# Altium project 8x8_Crosspoint_Switch.PrjPcb (part 4 of 4)
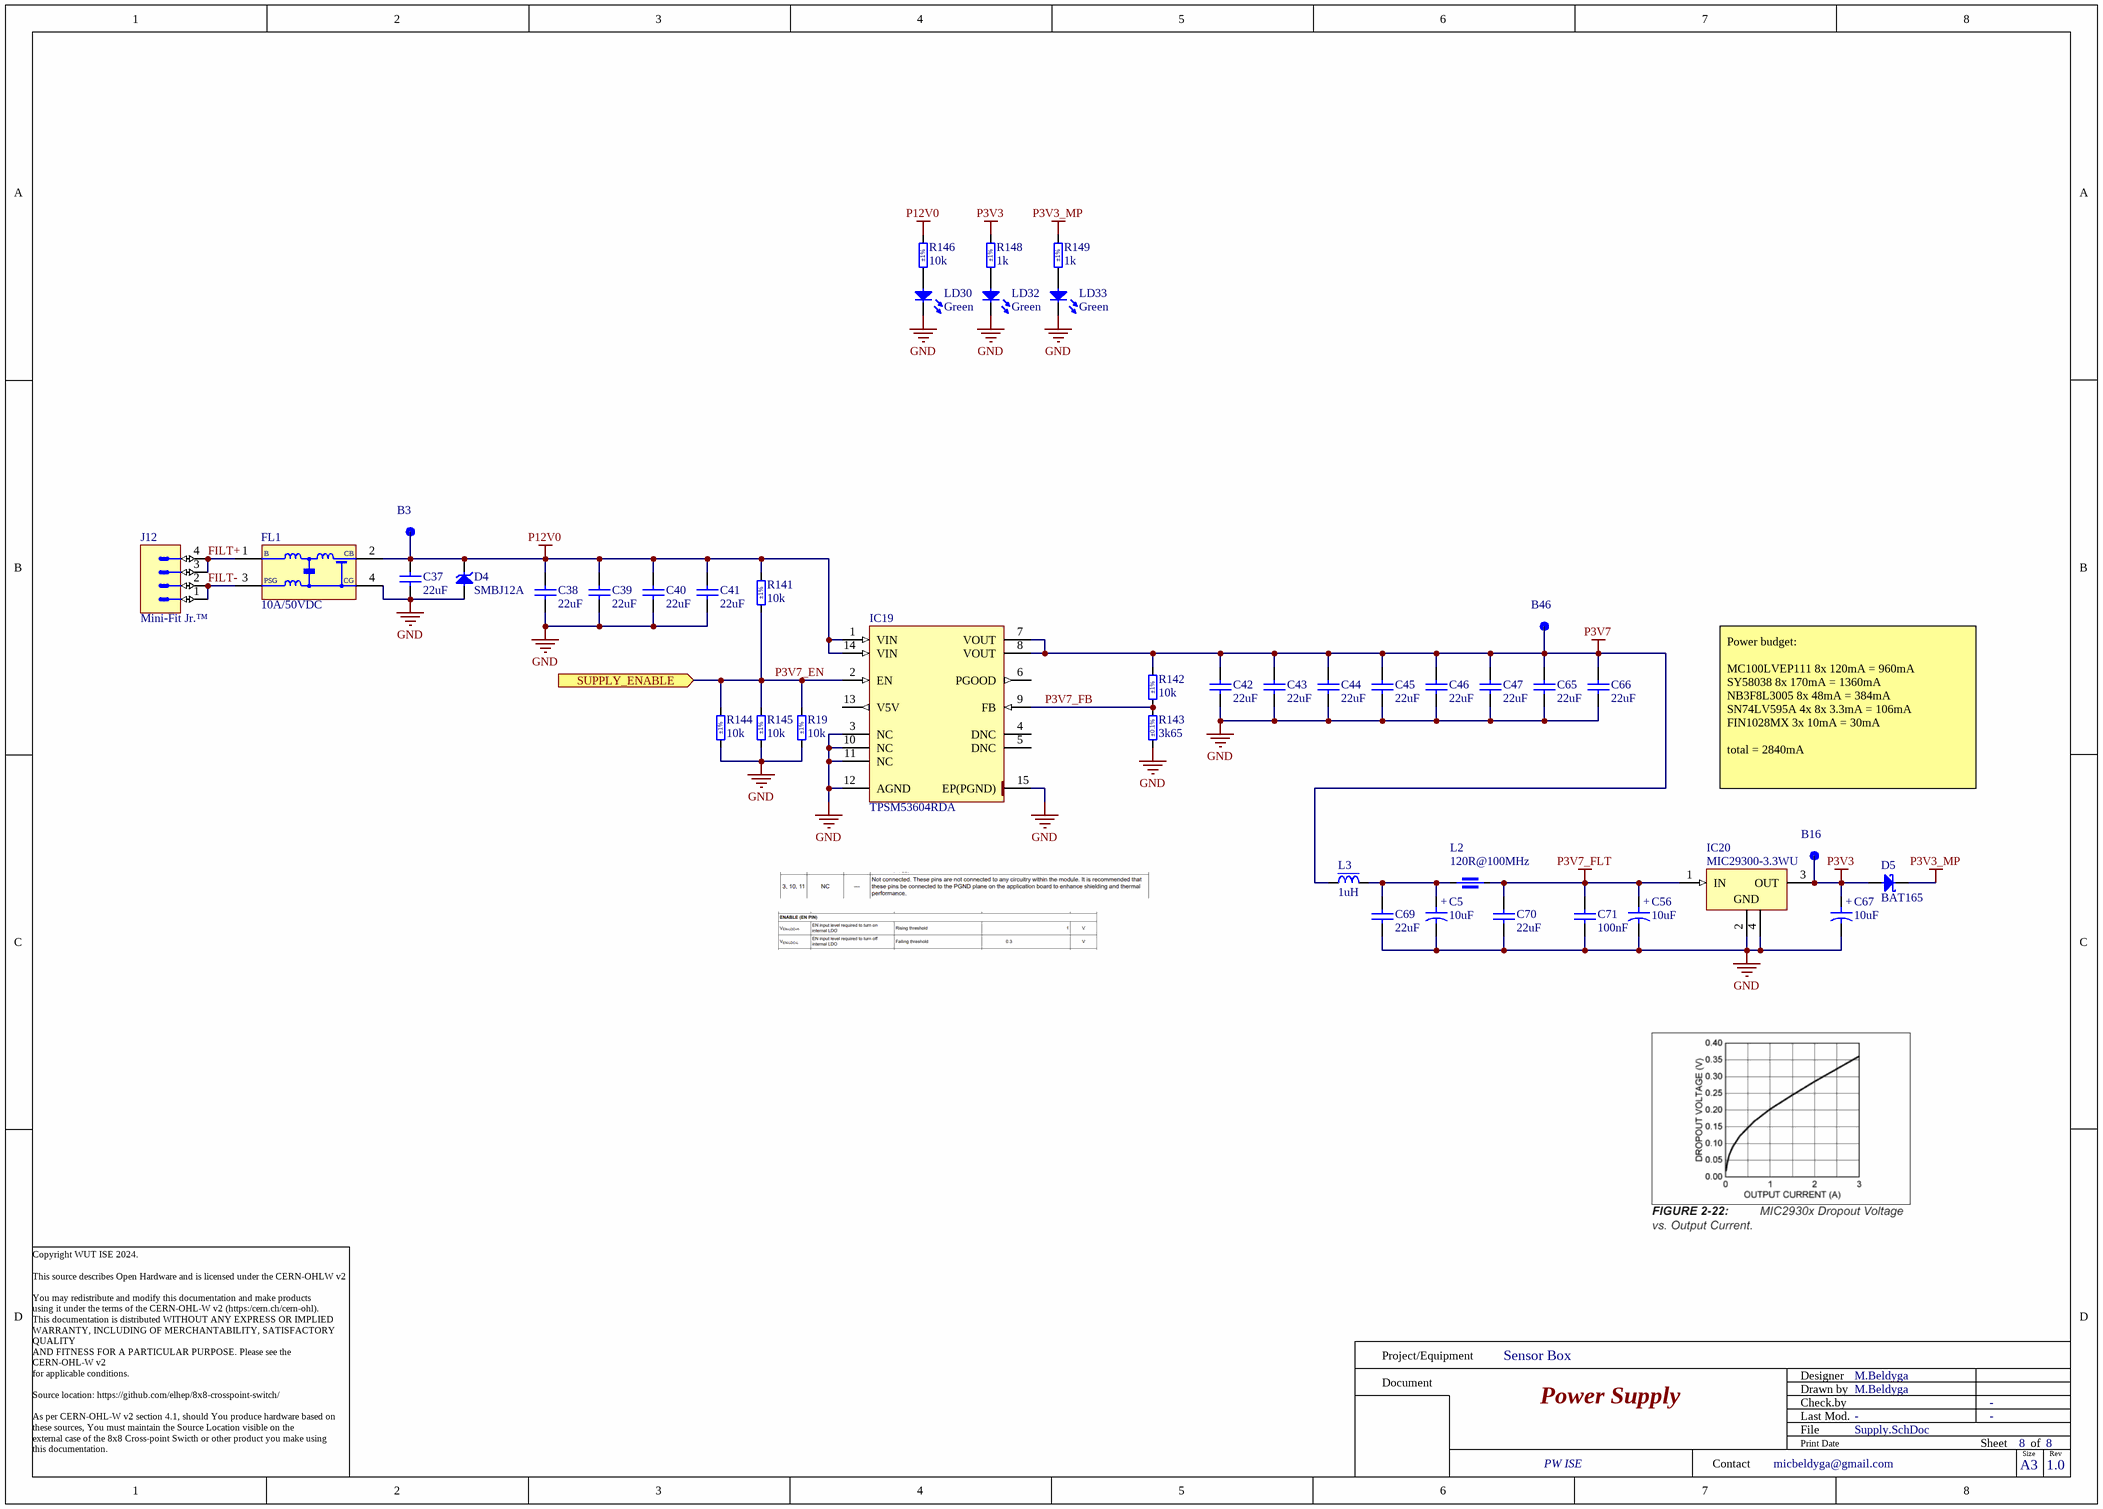
[diagram p8: Supply.SchDoc]

## Nets that join several sheets
GND: 8x8_Crosspoint (77 pins), U_Crosspoint/U_1-to-8_Fanout (12 pins), U_Crosspoint/U_1-to-8_Fanout (12 pins), U_Crosspoint/U_1-to-8_Fanout (12 pins), U_Crosspoint/U_1-to-8_Fanout (12 pins), U_Crosspoint/U_1-to-8_Fanout (12 pins), U_Crosspoint/U_1-to-8_Fanout (12 pins), U_Crosspoint/U_1-to-8_Fanout (12 pins), U_Crosspoint/U_1-to-8_Fanout (12 pins), U_Crosspoint/U_8-to-1_MUX (36 pins), U_Crosspoint/U_8-to-1_MUX (36 pins), U_Crosspoint/U_8-to-1_MUX (36 pins), U_Crosspoint/U_8-to-1_MUX (36 pins), U_Crosspoint/U_8-to-1_MUX (36 pins), U_Crosspoint/U_8-to-1_MUX (36 pins), U_Crosspoint/U_8-to-1_MUX (36 pins), U_Crosspoint/U_8-to-1_MUX (36 pins), Crosspoint_control (32 pins), DIOT_P1 (24 pins), EEM (38 pins), Supply (35 pins)
P3V3: 8x8_Crosspoint (B15.1 R18.2), U_Crosspoint/U_1-to-8_Fanout (C8A.2 C9A.2 D6A.1 L1A.1), U_Crosspoint/U_1-to-8_Fanout (C8B.2 C9B.2 D6B.1 L1B.1), U_Crosspoint/U_1-to-8_Fanout (C8C.2 C9C.2 D6C.1 L1C.1), U_Crosspoint/U_1-to-8_Fanout (C8D.2 C9D.2 D6D.1 L1D.1), U_Crosspoint/U_1-to-8_Fanout (C8E.2 C9E.2 D6E.1 L1E.1), U_Crosspoint/U_1-to-8_Fanout (C8F.2 C9F.2 D6F.1 L1F.1), U_Crosspoint/U_1-to-8_Fanout (C8G.2 C9G.2 D6G.1 L1G.1), U_Crosspoint/U_1-to-8_Fanout (C8H.2 C9H.2 D6H.1 L1H.1), U_Crosspoint/U_8-to-1_MUX (14 pins), U_Crosspoint/U_8-to-1_MUX (14 pins), U_Crosspoint/U_8-to-1_MUX (14 pins), U_Crosspoint/U_8-to-1_MUX (14 pins), U_Crosspoint/U_8-to-1_MUX (14 pins), U_Crosspoint/U_8-to-1_MUX (14 pins), U_Crosspoint/U_8-to-1_MUX (14 pins), U_Crosspoint/U_8-to-1_MUX (14 pins), Crosspoint_control (12 pins), DIOT_P1 (D2.4), EEM (12 pins), Supply (5 pins)
P3V3_MP: 8x8_Crosspoint (B14.1 D1.1 R17.2), DIOT_P1 (C27.2 IC8.14), EEM (19 pins), Supply (D5.1 R149.2)
P12V0: 8x8_Crosspoint (B17.1 R20.2), DIOT_P1 (7 pins), EEM (J11.28 J11.29), Supply (12 pins)
ARDU_CSn: 8x8_Crosspoint (R23.1), EEM (IC9.13)
ARDU_MISO: 8x8_Crosspoint (R28.1), EEM (IC12.3)
ARDU_MOSI: 8x8_Crosspoint (PCBM1.14), EEM (IC12.13)
ARDU_MUX: 8x8_Crosspoint (R21.1 R24.2), EEM (10 pins)
ARDU_OE: 8x8_Crosspoint (R22.1 R25.2), EEM (IC9.3)
ARDU_SCK: 8x8_Crosspoint (R33.2), EEM (IC12.1)
ARDU_SCL: 8x8_Crosspoint (B18.1 PCBM1.24), EEM (IC17.8 IC17.11 R137.1)
ARDU_SDA: 8x8_Crosspoint (B19.1 PCBM1.23), EEM (IC17.1 IC17.4 R128.1)
CLK_0_OUT_0.CLK_N: U_Crosspoint/U_1-to-8_Fanout (IC1A.30), U_Crosspoint/U_8-to-1_MUX (IC3A.36)
CLK_0_OUT_0.CLK_P: U_Crosspoint/U_1-to-8_Fanout (IC1A.31), U_Crosspoint/U_8-to-1_MUX (IC3A.38)
CLK_0_OUT_1.CLK_N: U_Crosspoint/U_1-to-8_Fanout (IC1A.28), U_Crosspoint/U_8-to-1_MUX (IC3B.36)
CLK_0_OUT_1.CLK_P: U_Crosspoint/U_1-to-8_Fanout (IC1A.29), U_Crosspoint/U_8-to-1_MUX (IC3B.38)
CLK_0_OUT_2.CLK_N: U_Crosspoint/U_1-to-8_Fanout (IC1A.26), U_Crosspoint/U_8-to-1_MUX (IC3C.36)
CLK_0_OUT_2.CLK_P: U_Crosspoint/U_1-to-8_Fanout (IC1A.27), U_Crosspoint/U_8-to-1_MUX (IC3C.38)
CLK_0_OUT_3.CLK_N: U_Crosspoint/U_1-to-8_Fanout (IC1A.23), U_Crosspoint/U_8-to-1_MUX (IC3D.36)
CLK_0_OUT_3.CLK_P: U_Crosspoint/U_1-to-8_Fanout (IC1A.24), U_Crosspoint/U_8-to-1_MUX (IC3D.38)
CLK_0_OUT_4.CLK_N: U_Crosspoint/U_1-to-8_Fanout (IC1A.21), U_Crosspoint/U_8-to-1_MUX (IC3E.36)
CLK_0_OUT_4.CLK_P: U_Crosspoint/U_1-to-8_Fanout (IC1A.22), U_Crosspoint/U_8-to-1_MUX (IC3E.38)
CLK_0_OUT_5.CLK_N: U_Crosspoint/U_1-to-8_Fanout (IC1A.19), U_Crosspoint/U_8-to-1_MUX (IC3F.36)
CLK_0_OUT_5.CLK_P: U_Crosspoint/U_1-to-8_Fanout (IC1A.20), U_Crosspoint/U_8-to-1_MUX (IC3F.38)
CLK_0_OUT_6.CLK_N: U_Crosspoint/U_1-to-8_Fanout (IC1A.17), U_Crosspoint/U_8-to-1_MUX (IC3G.36)
CLK_0_OUT_6.CLK_P: U_Crosspoint/U_1-to-8_Fanout (IC1A.18), U_Crosspoint/U_8-to-1_MUX (IC3G.38)
CLK_0_OUT_7.CLK_N: U_Crosspoint/U_1-to-8_Fanout (IC1A.14), U_Crosspoint/U_8-to-1_MUX (IC3H.36)
CLK_0_OUT_7.CLK_P: U_Crosspoint/U_1-to-8_Fanout (IC1A.15), U_Crosspoint/U_8-to-1_MUX (IC3H.38)
CLK_1_OUT_0.CLK_N: U_Crosspoint/U_1-to-8_Fanout (IC1B.30), U_Crosspoint/U_8-to-1_MUX (IC3A.40)
CLK_1_OUT_0.CLK_P: U_Crosspoint/U_1-to-8_Fanout (IC1B.31), U_Crosspoint/U_8-to-1_MUX (IC3A.42)
CLK_1_OUT_1.CLK_N: U_Crosspoint/U_1-to-8_Fanout (IC1B.28), U_Crosspoint/U_8-to-1_MUX (IC3B.40)
CLK_1_OUT_1.CLK_P: U_Crosspoint/U_1-to-8_Fanout (IC1B.29), U_Crosspoint/U_8-to-1_MUX (IC3B.42)
CLK_1_OUT_2.CLK_N: U_Crosspoint/U_1-to-8_Fanout (IC1B.26), U_Crosspoint/U_8-to-1_MUX (IC3C.40)
CLK_1_OUT_2.CLK_P: U_Crosspoint/U_1-to-8_Fanout (IC1B.27), U_Crosspoint/U_8-to-1_MUX (IC3C.42)
CLK_1_OUT_3.CLK_N: U_Crosspoint/U_1-to-8_Fanout (IC1B.23), U_Crosspoint/U_8-to-1_MUX (IC3D.40)
CLK_1_OUT_3.CLK_P: U_Crosspoint/U_1-to-8_Fanout (IC1B.24), U_Crosspoint/U_8-to-1_MUX (IC3D.42)
CLK_1_OUT_4.CLK_N: U_Crosspoint/U_1-to-8_Fanout (IC1B.21), U_Crosspoint/U_8-to-1_MUX (IC3E.40)
CLK_1_OUT_4.CLK_P: U_Crosspoint/U_1-to-8_Fanout (IC1B.22), U_Crosspoint/U_8-to-1_MUX (IC3E.42)
CLK_1_OUT_5.CLK_N: U_Crosspoint/U_1-to-8_Fanout (IC1B.19), U_Crosspoint/U_8-to-1_MUX (IC3F.40)
CLK_1_OUT_5.CLK_P: U_Crosspoint/U_1-to-8_Fanout (IC1B.20), U_Crosspoint/U_8-to-1_MUX (IC3F.42)
CLK_1_OUT_6.CLK_N: U_Crosspoint/U_1-to-8_Fanout (IC1B.17), U_Crosspoint/U_8-to-1_MUX (IC3G.40)
CLK_1_OUT_6.CLK_P: U_Crosspoint/U_1-to-8_Fanout (IC1B.18), U_Crosspoint/U_8-to-1_MUX (IC3G.42)
CLK_1_OUT_7.CLK_N: U_Crosspoint/U_1-to-8_Fanout (IC1B.14), U_Crosspoint/U_8-to-1_MUX (IC3H.40)
CLK_1_OUT_7.CLK_P: U_Crosspoint/U_1-to-8_Fanout (IC1B.15), U_Crosspoint/U_8-to-1_MUX (IC3H.42)
CLK_2_OUT_0.CLK_N: U_Crosspoint/U_1-to-8_Fanout (IC1C.30), U_Crosspoint/U_8-to-1_MUX (IC3A.43)
CLK_2_OUT_0.CLK_P: U_Crosspoint/U_1-to-8_Fanout (IC1C.31), U_Crosspoint/U_8-to-1_MUX (IC3A.1)
CLK_2_OUT_1.CLK_N: U_Crosspoint/U_1-to-8_Fanout (IC1C.28), U_Crosspoint/U_8-to-1_MUX (IC3B.43)
CLK_2_OUT_1.CLK_P: U_Crosspoint/U_1-to-8_Fanout (IC1C.29), U_Crosspoint/U_8-to-1_MUX (IC3B.1)
CLK_2_OUT_2.CLK_N: U_Crosspoint/U_1-to-8_Fanout (IC1C.26), U_Crosspoint/U_8-to-1_MUX (IC3C.43)
CLK_2_OUT_2.CLK_P: U_Crosspoint/U_1-to-8_Fanout (IC1C.27), U_Crosspoint/U_8-to-1_MUX (IC3C.1)
CLK_2_OUT_3.CLK_N: U_Crosspoint/U_1-to-8_Fanout (IC1C.23), U_Crosspoint/U_8-to-1_MUX (IC3D.43)
CLK_2_OUT_3.CLK_P: U_Crosspoint/U_1-to-8_Fanout (IC1C.24), U_Crosspoint/U_8-to-1_MUX (IC3D.1)
CLK_2_OUT_4.CLK_N: U_Crosspoint/U_1-to-8_Fanout (IC1C.21), U_Crosspoint/U_8-to-1_MUX (IC3E.43)
CLK_2_OUT_4.CLK_P: U_Crosspoint/U_1-to-8_Fanout (IC1C.22), U_Crosspoint/U_8-to-1_MUX (IC3E.1)
CLK_2_OUT_5.CLK_N: U_Crosspoint/U_1-to-8_Fanout (IC1C.19), U_Crosspoint/U_8-to-1_MUX (IC3F.43)
CLK_2_OUT_5.CLK_P: U_Crosspoint/U_1-to-8_Fanout (IC1C.20), U_Crosspoint/U_8-to-1_MUX (IC3F.1)
CLK_2_OUT_6.CLK_N: U_Crosspoint/U_1-to-8_Fanout (IC1C.17), U_Crosspoint/U_8-to-1_MUX (IC3G.43)
CLK_2_OUT_6.CLK_P: U_Crosspoint/U_1-to-8_Fanout (IC1C.18), U_Crosspoint/U_8-to-1_MUX (IC3G.1)
CLK_2_OUT_7.CLK_N: U_Crosspoint/U_1-to-8_Fanout (IC1C.14), U_Crosspoint/U_8-to-1_MUX (IC3H.43)
CLK_2_OUT_7.CLK_P: U_Crosspoint/U_1-to-8_Fanout (IC1C.15), U_Crosspoint/U_8-to-1_MUX (IC3H.1)
CLK_3_OUT_0.CLK_N: U_Crosspoint/U_1-to-8_Fanout (IC1D.30), U_Crosspoint/U_8-to-1_MUX (IC3A.3)
CLK_3_OUT_0.CLK_P: U_Crosspoint/U_1-to-8_Fanout (IC1D.31), U_Crosspoint/U_8-to-1_MUX (IC3A.5)
CLK_3_OUT_1.CLK_N: U_Crosspoint/U_1-to-8_Fanout (IC1D.28), U_Crosspoint/U_8-to-1_MUX (IC3B.3)
CLK_3_OUT_1.CLK_P: U_Crosspoint/U_1-to-8_Fanout (IC1D.29), U_Crosspoint/U_8-to-1_MUX (IC3B.5)
CLK_3_OUT_2.CLK_N: U_Crosspoint/U_1-to-8_Fanout (IC1D.26), U_Crosspoint/U_8-to-1_MUX (IC3C.3)
CLK_3_OUT_2.CLK_P: U_Crosspoint/U_1-to-8_Fanout (IC1D.27), U_Crosspoint/U_8-to-1_MUX (IC3C.5)
CLK_3_OUT_3.CLK_N: U_Crosspoint/U_1-to-8_Fanout (IC1D.23), U_Crosspoint/U_8-to-1_MUX (IC3D.3)
CLK_3_OUT_3.CLK_P: U_Crosspoint/U_1-to-8_Fanout (IC1D.24), U_Crosspoint/U_8-to-1_MUX (IC3D.5)
CLK_3_OUT_4.CLK_N: U_Crosspoint/U_1-to-8_Fanout (IC1D.21), U_Crosspoint/U_8-to-1_MUX (IC3E.3)
CLK_3_OUT_4.CLK_P: U_Crosspoint/U_1-to-8_Fanout (IC1D.22), U_Crosspoint/U_8-to-1_MUX (IC3E.5)
CLK_3_OUT_5.CLK_N: U_Crosspoint/U_1-to-8_Fanout (IC1D.19), U_Crosspoint/U_8-to-1_MUX (IC3F.3)
CLK_3_OUT_5.CLK_P: U_Crosspoint/U_1-to-8_Fanout (IC1D.20), U_Crosspoint/U_8-to-1_MUX (IC3F.5)
CLK_3_OUT_6.CLK_N: U_Crosspoint/U_1-to-8_Fanout (IC1D.17), U_Crosspoint/U_8-to-1_MUX (IC3G.3)
CLK_3_OUT_6.CLK_P: U_Crosspoint/U_1-to-8_Fanout (IC1D.18), U_Crosspoint/U_8-to-1_MUX (IC3G.5)
CLK_3_OUT_7.CLK_N: U_Crosspoint/U_1-to-8_Fanout (IC1D.14), U_Crosspoint/U_8-to-1_MUX (IC3H.3)
CLK_3_OUT_7.CLK_P: U_Crosspoint/U_1-to-8_Fanout (IC1D.15), U_Crosspoint/U_8-to-1_MUX (IC3H.5)
CLK_4_OUT_0.CLK_N: U_Crosspoint/U_1-to-8_Fanout (IC1E.30), U_Crosspoint/U_8-to-1_MUX (IC3A.7)
CLK_4_OUT_0.CLK_P: U_Crosspoint/U_1-to-8_Fanout (IC1E.31), U_Crosspoint/U_8-to-1_MUX (IC3A.9)
CLK_4_OUT_1.CLK_N: U_Crosspoint/U_1-to-8_Fanout (IC1E.28), U_Crosspoint/U_8-to-1_MUX (IC3B.7)
CLK_4_OUT_1.CLK_P: U_Crosspoint/U_1-to-8_Fanout (IC1E.29), U_Crosspoint/U_8-to-1_MUX (IC3B.9)
CLK_4_OUT_2.CLK_N: U_Crosspoint/U_1-to-8_Fanout (IC1E.26), U_Crosspoint/U_8-to-1_MUX (IC3C.7)
CLK_4_OUT_2.CLK_P: U_Crosspoint/U_1-to-8_Fanout (IC1E.27), U_Crosspoint/U_8-to-1_MUX (IC3C.9)
CLK_4_OUT_3.CLK_N: U_Crosspoint/U_1-to-8_Fanout (IC1E.23), U_Crosspoint/U_8-to-1_MUX (IC3D.7)
CLK_4_OUT_3.CLK_P: U_Crosspoint/U_1-to-8_Fanout (IC1E.24), U_Crosspoint/U_8-to-1_MUX (IC3D.9)
CLK_4_OUT_4.CLK_N: U_Crosspoint/U_1-to-8_Fanout (IC1E.21), U_Crosspoint/U_8-to-1_MUX (IC3E.7)
CLK_4_OUT_4.CLK_P: U_Crosspoint/U_1-to-8_Fanout (IC1E.22), U_Crosspoint/U_8-to-1_MUX (IC3E.9)
CLK_4_OUT_5.CLK_N: U_Crosspoint/U_1-to-8_Fanout (IC1E.19), U_Crosspoint/U_8-to-1_MUX (IC3F.7)
CLK_4_OUT_5.CLK_P: U_Crosspoint/U_1-to-8_Fanout (IC1E.20), U_Crosspoint/U_8-to-1_MUX (IC3F.9)
CLK_4_OUT_6.CLK_N: U_Crosspoint/U_1-to-8_Fanout (IC1E.17), U_Crosspoint/U_8-to-1_MUX (IC3G.7)
CLK_4_OUT_6.CLK_P: U_Crosspoint/U_1-to-8_Fanout (IC1E.18), U_Crosspoint/U_8-to-1_MUX (IC3G.9)
CLK_4_OUT_7.CLK_N: U_Crosspoint/U_1-to-8_Fanout (IC1E.14), U_Crosspoint/U_8-to-1_MUX (IC3H.7)
CLK_4_OUT_7.CLK_P: U_Crosspoint/U_1-to-8_Fanout (IC1E.15), U_Crosspoint/U_8-to-1_MUX (IC3H.9)
CLK_5_OUT_0.CLK_N: U_Crosspoint/U_1-to-8_Fanout (IC1F.30), U_Crosspoint/U_8-to-1_MUX (IC3A.11)
CLK_5_OUT_0.CLK_P: U_Crosspoint/U_1-to-8_Fanout (IC1F.31), U_Crosspoint/U_8-to-1_MUX (IC3A.13)
CLK_5_OUT_1.CLK_N: U_Crosspoint/U_1-to-8_Fanout (IC1F.28), U_Crosspoint/U_8-to-1_MUX (IC3B.11)
CLK_5_OUT_1.CLK_P: U_Crosspoint/U_1-to-8_Fanout (IC1F.29), U_Crosspoint/U_8-to-1_MUX (IC3B.13)
CLK_5_OUT_2.CLK_N: U_Crosspoint/U_1-to-8_Fanout (IC1F.26), U_Crosspoint/U_8-to-1_MUX (IC3C.11)
CLK_5_OUT_2.CLK_P: U_Crosspoint/U_1-to-8_Fanout (IC1F.27), U_Crosspoint/U_8-to-1_MUX (IC3C.13)
CLK_5_OUT_3.CLK_N: U_Crosspoint/U_1-to-8_Fanout (IC1F.23), U_Crosspoint/U_8-to-1_MUX (IC3D.11)
CLK_5_OUT_3.CLK_P: U_Crosspoint/U_1-to-8_Fanout (IC1F.24), U_Crosspoint/U_8-to-1_MUX (IC3D.13)
CLK_5_OUT_4.CLK_N: U_Crosspoint/U_1-to-8_Fanout (IC1F.21), U_Crosspoint/U_8-to-1_MUX (IC3E.11)
CLK_5_OUT_4.CLK_P: U_Crosspoint/U_1-to-8_Fanout (IC1F.22), U_Crosspoint/U_8-to-1_MUX (IC3E.13)
CLK_5_OUT_5.CLK_N: U_Crosspoint/U_1-to-8_Fanout (IC1F.19), U_Crosspoint/U_8-to-1_MUX (IC3F.11)
CLK_5_OUT_5.CLK_P: U_Crosspoint/U_1-to-8_Fanout (IC1F.20), U_Crosspoint/U_8-to-1_MUX (IC3F.13)
CLK_5_OUT_6.CLK_N: U_Crosspoint/U_1-to-8_Fanout (IC1F.17), U_Crosspoint/U_8-to-1_MUX (IC3G.11)
CLK_5_OUT_6.CLK_P: U_Crosspoint/U_1-to-8_Fanout (IC1F.18), U_Crosspoint/U_8-to-1_MUX (IC3G.13)
CLK_5_OUT_7.CLK_N: U_Crosspoint/U_1-to-8_Fanout (IC1F.14), U_Crosspoint/U_8-to-1_MUX (IC3H.11)
CLK_5_OUT_7.CLK_P: U_Crosspoint/U_1-to-8_Fanout (IC1F.15), U_Crosspoint/U_8-to-1_MUX (IC3H.13)
CLK_6_OUT_0.CLK_N: U_Crosspoint/U_1-to-8_Fanout (IC1G.30), U_Crosspoint/U_8-to-1_MUX (IC3A.14)
CLK_6_OUT_0.CLK_P: U_Crosspoint/U_1-to-8_Fanout (IC1G.31), U_Crosspoint/U_8-to-1_MUX (IC3A.16)
CLK_6_OUT_1.CLK_N: U_Crosspoint/U_1-to-8_Fanout (IC1G.28), U_Crosspoint/U_8-to-1_MUX (IC3B.14)
CLK_6_OUT_1.CLK_P: U_Crosspoint/U_1-to-8_Fanout (IC1G.29), U_Crosspoint/U_8-to-1_MUX (IC3B.16)
CLK_6_OUT_2.CLK_N: U_Crosspoint/U_1-to-8_Fanout (IC1G.26), U_Crosspoint/U_8-to-1_MUX (IC3C.14)
CLK_6_OUT_2.CLK_P: U_Crosspoint/U_1-to-8_Fanout (IC1G.27), U_Crosspoint/U_8-to-1_MUX (IC3C.16)
CLK_6_OUT_3.CLK_N: U_Crosspoint/U_1-to-8_Fanout (IC1G.23), U_Crosspoint/U_8-to-1_MUX (IC3D.14)
CLK_6_OUT_3.CLK_P: U_Crosspoint/U_1-to-8_Fanout (IC1G.24), U_Crosspoint/U_8-to-1_MUX (IC3D.16)
CLK_6_OUT_4.CLK_N: U_Crosspoint/U_1-to-8_Fanout (IC1G.21), U_Crosspoint/U_8-to-1_MUX (IC3E.14)
CLK_6_OUT_4.CLK_P: U_Crosspoint/U_1-to-8_Fanout (IC1G.22), U_Crosspoint/U_8-to-1_MUX (IC3E.16)
CLK_6_OUT_5.CLK_N: U_Crosspoint/U_1-to-8_Fanout (IC1G.19), U_Crosspoint/U_8-to-1_MUX (IC3F.14)
CLK_6_OUT_5.CLK_P: U_Crosspoint/U_1-to-8_Fanout (IC1G.20), U_Crosspoint/U_8-to-1_MUX (IC3F.16)
CLK_6_OUT_6.CLK_N: U_Crosspoint/U_1-to-8_Fanout (IC1G.17), U_Crosspoint/U_8-to-1_MUX (IC3G.14)
CLK_6_OUT_6.CLK_P: U_Crosspoint/U_1-to-8_Fanout (IC1G.18), U_Crosspoint/U_8-to-1_MUX (IC3G.16)
CLK_6_OUT_7.CLK_N: U_Crosspoint/U_1-to-8_Fanout (IC1G.14), U_Crosspoint/U_8-to-1_MUX (IC3H.14)
CLK_6_OUT_7.CLK_P: U_Crosspoint/U_1-to-8_Fanout (IC1G.15), U_Crosspoint/U_8-to-1_MUX (IC3H.16)
CLK_7_OUT_0.CLK_N: U_Crosspoint/U_1-to-8_Fanout (IC1H.30), U_Crosspoint/U_8-to-1_MUX (IC3A.18)
CLK_7_OUT_0.CLK_P: U_Crosspoint/U_1-to-8_Fanout (IC1H.31), U_Crosspoint/U_8-to-1_MUX (IC3A.20)
CLK_7_OUT_1.CLK_N: U_Crosspoint/U_1-to-8_Fanout (IC1H.28), U_Crosspoint/U_8-to-1_MUX (IC3B.18)
CLK_7_OUT_1.CLK_P: U_Crosspoint/U_1-to-8_Fanout (IC1H.29), U_Crosspoint/U_8-to-1_MUX (IC3B.20)
CLK_7_OUT_2.CLK_N: U_Crosspoint/U_1-to-8_Fanout (IC1H.26), U_Crosspoint/U_8-to-1_MUX (IC3C.18)
CLK_7_OUT_2.CLK_P: U_Crosspoint/U_1-to-8_Fanout (IC1H.27), U_Crosspoint/U_8-to-1_MUX (IC3C.20)
CLK_7_OUT_3.CLK_N: U_Crosspoint/U_1-to-8_Fanout (IC1H.23), U_Crosspoint/U_8-to-1_MUX (IC3D.18)
CLK_7_OUT_3.CLK_P: U_Crosspoint/U_1-to-8_Fanout (IC1H.24), U_Crosspoint/U_8-to-1_MUX (IC3D.20)
CLK_7_OUT_4.CLK_N: U_Crosspoint/U_1-to-8_Fanout (IC1H.21), U_Crosspoint/U_8-to-1_MUX (IC3E.18)
CLK_7_OUT_4.CLK_P: U_Crosspoint/U_1-to-8_Fanout (IC1H.22), U_Crosspoint/U_8-to-1_MUX (IC3E.20)
CLK_7_OUT_5.CLK_N: U_Crosspoint/U_1-to-8_Fanout (IC1H.19), U_Crosspoint/U_8-to-1_MUX (IC3F.18)
CLK_7_OUT_5.CLK_P: U_Crosspoint/U_1-to-8_Fanout (IC1H.20), U_Crosspoint/U_8-to-1_MUX (IC3F.20)
CLK_7_OUT_6.CLK_N: U_Crosspoint/U_1-to-8_Fanout (IC1H.17), U_Crosspoint/U_8-to-1_MUX (IC3G.18)
CLK_7_OUT_6.CLK_P: U_Crosspoint/U_1-to-8_Fanout (IC1H.18), U_Crosspoint/U_8-to-1_MUX (IC3G.20)
CLK_7_OUT_7.CLK_N: U_Crosspoint/U_1-to-8_Fanout (IC1H.14), U_Crosspoint/U_8-to-1_MUX (IC3H.18)
CLK_7_OUT_7.CLK_P: U_Crosspoint/U_1-to-8_Fanout (IC1H.15), U_Crosspoint/U_8-to-1_MUX (IC3H.20)
CLK_IN_0: 8x8_Crosspoint (J1.1 R1.2), U_Crosspoint/U_1-to-8_Fanout (R153A.1)
CLK_IN_1: 8x8_Crosspoint (J2.1 R2.2), U_Crosspoint/U_1-to-8_Fanout (R153B.1)
CLK_IN_2: 8x8_Crosspoint (J4.1 R3.2), U_Crosspoint/U_1-to-8_Fanout (R153C.1)
CLK_IN_3: 8x8_Crosspoint (J5.1 R4.2), U_Crosspoint/U_1-to-8_Fanout (R153D.1)
CLK_IN_4: 8x8_Crosspoint (J6.1 R5.2), U_Crosspoint/U_1-to-8_Fanout (R153E.1)
CLK_IN_5: 8x8_Crosspoint (J7.1 R6.2), U_Crosspoint/U_1-to-8_Fanout (R153F.1)
CLK_IN_6: 8x8_Crosspoint (J8.1 R7.2), U_Crosspoint/U_1-to-8_Fanout (R153G.1)
CLK_IN_7: 8x8_Crosspoint (J9.1 R8.2), U_Crosspoint/U_1-to-8_Fanout (R153H.1)
CLK_OUT_0: 8x8_Crosspoint (J3.23), U_Crosspoint/U_8-to-1_MUX (F1A.2)
CLK_OUT_1: 8x8_Crosspoint (J3.20), U_Crosspoint/U_8-to-1_MUX (F1B.2)
CLK_OUT_2: 8x8_Crosspoint (J3.17), U_Crosspoint/U_8-to-1_MUX (F1C.2)
CLK_OUT_3: 8x8_Crosspoint (J3.14), U_Crosspoint/U_8-to-1_MUX (F1D.2)
CLK_OUT_4: 8x8_Crosspoint (J3.11), U_Crosspoint/U_8-to-1_MUX (F1E.2)
CLK_OUT_5: 8x8_Crosspoint (J3.8), U_Crosspoint/U_8-to-1_MUX (F1F.2)
CLK_OUT_6: 8x8_Crosspoint (J3.5), U_Crosspoint/U_8-to-1_MUX (F1G.2)
CLK_OUT_7: 8x8_Crosspoint (J3.2), U_Crosspoint/U_8-to-1_MUX (F1H.2)
DESER_CSn: Crosspoint_control (IC4.12 IC5.12 IC6.12 IC7.12), EEM (IC9.14 IC16.1)
DESER_MISO: Crosspoint_control (IC7.9), EEM (IC16.2)
DESER_MOSI: Crosspoint_control (IC4.14), EEM (IC12.14)
DESER_~{OE}: Crosspoint_control (IC4.13 IC5.13 IC6.13 IC7.13), EEM (IC9.4)
DESER_SCK: Crosspoint_control (IC4.11 IC5.11 IC6.11 IC7.11), EEM (IC12.15)
EEM0_0_N: DIOT_P1 (R104.2), EEM (IC11.4 J11.3 R126.2)
EEM0_0_P: DIOT_P1 (R103.2), EEM (IC11.3 J11.2 R126.1)
EEM0_1_N: DIOT_P1 (R106.2), EEM (IC11.1 J11.6 R124.1)
EEM0_1_P: DIOT_P1 (R105.2), EEM (IC11.2 J11.5 R124.2)
EEM0_2_N: DIOT_P1 (R108.2), EEM (IC14.7 J11.9)
EEM0_2_P: DIOT_P1 (R107.2), EEM (IC14.8 J11.8)
EEM0_3_N: DIOT_P1 (R110.2), EEM (IC10.3 J11.12 R122.1)
EEM0_3_P: DIOT_P1 (R109.2), EEM (IC10.4 J11.11 R122.2)
EEM0_4_N: DIOT_P1 (R112.2), EEM (J11.15)
EEM0_4_P: DIOT_P1 (R111.2), EEM (J11.14)
EEM0_5_N: DIOT_P1 (R114.2), EEM (IC10.2 J11.18 R120.2)
EEM0_5_P: DIOT_P1 (R113.2), EEM (IC10.1 J11.17 R120.1)
EEM0_6_N: DIOT_P1 (R116.2), EEM (J11.21)
EEM0_6_P: DIOT_P1 (R115.2), EEM (J11.20)
EEM0_7_N: DIOT_P1 (R118.2), EEM (J11.24)
EEM0_7_P: DIOT_P1 (R117.2), EEM (J11.23)
I2C0_SCL: DIOT_P1 (B27.1 IC8.9 IC8.10), EEM (8 pins)
I2C0_SDA: DIOT_P1 (B26.1 IC8.2 IC8.3), EEM (8 pins)
OUT_0_SEL_0: U_Crosspoint/U_8-to-1_MUX (IC3A.21), Crosspoint_control (R53.2)
OUT_0_SEL_1: U_Crosspoint/U_8-to-1_MUX (IC3A.22), Crosspoint_control (R55.2)
OUT_0_SEL_2: U_Crosspoint/U_8-to-1_MUX (IC3A.35), Crosspoint_control (R46.2)
OUT_1_SEL_0: U_Crosspoint/U_8-to-1_MUX (IC3B.21), Crosspoint_control (R49.2)
OUT_1_SEL_1: U_Crosspoint/U_8-to-1_MUX (IC3B.22), Crosspoint_control (R50.2)
OUT_1_SEL_2: U_Crosspoint/U_8-to-1_MUX (IC3B.35), Crosspoint_control (R52.2)
OUT_2_SEL_0: U_Crosspoint/U_8-to-1_MUX (IC3C.21), Crosspoint_control (R64.2)
OUT_2_SEL_1: U_Crosspoint/U_8-to-1_MUX (IC3C.22), Crosspoint_control (R47.2)
OUT_2_SEL_2: U_Crosspoint/U_8-to-1_MUX (IC3C.35), Crosspoint_control (R48.2)
OUT_3_SEL_0: U_Crosspoint/U_8-to-1_MUX (IC3D.21), Crosspoint_control (R72.2)
OUT_3_SEL_1: U_Crosspoint/U_8-to-1_MUX (IC3D.22), Crosspoint_control (R73.2)
OUT_3_SEL_2: U_Crosspoint/U_8-to-1_MUX (IC3D.35), Crosspoint_control (R75.2)
OUT_4_SEL_0: U_Crosspoint/U_8-to-1_MUX (IC3E.21), Crosspoint_control (R67.2)
OUT_4_SEL_1: U_Crosspoint/U_8-to-1_MUX (IC3E.22), Crosspoint_control (R69.2)
OUT_4_SEL_2: U_Crosspoint/U_8-to-1_MUX (IC3E.35), Crosspoint_control (R70.2)
OUT_5_SEL_0: U_Crosspoint/U_8-to-1_MUX (IC3F.21), Crosspoint_control (R93.2)
OUT_5_SEL_1: U_Crosspoint/U_8-to-1_MUX (IC3F.22), Crosspoint_control (R84.2)
OUT_5_SEL_2: U_Crosspoint/U_8-to-1_MUX (IC3F.35), Crosspoint_control (R66.2)
OUT_6_SEL_0: U_Crosspoint/U_8-to-1_MUX (IC3G.21), Crosspoint_control (R92.2)
OUT_6_SEL_1: U_Crosspoint/U_8-to-1_MUX (IC3G.22), Crosspoint_control (R90.2)
OUT_6_SEL_2: U_Crosspoint/U_8-to-1_MUX (IC3G.35), Crosspoint_control (R91.2)
OUT_7_SEL_0: U_Crosspoint/U_8-to-1_MUX (IC3H.21), Crosspoint_control (R89.2)
OUT_7_SEL_1: U_Crosspoint/U_8-to-1_MUX (IC3H.22), Crosspoint_control (R86.2)
OUT_7_SEL_2: U_Crosspoint/U_8-to-1_MUX (IC3H.35), Crosspoint_control (R87.2)
P3V7_EN: EEM (R130.1 R136.2), Supply (5 pins)
TERM_EN_0: 8x8_Crosspoint (R9.1 T1.1), Crosspoint_control (R101.2)
TERM_EN_1: 8x8_Crosspoint (R10.1 T2.1), Crosspoint_control (R100.2)
TERM_EN_2: 8x8_Crosspoint (R11.1 T3.1), Crosspoint_control (R99.2)
TERM_EN_3: 8x8_Crosspoint (R12.1 T4.1), Crosspoint_control (R98.2)
TERM_EN_4: 8x8_Crosspoint (R13.1 T5.1), Crosspoint_control (R97.2)
TERM_EN_5: 8x8_Crosspoint (R14.1 T6.1), Crosspoint_control (R96.2)
TERM_EN_6: 8x8_Crosspoint (R15.1 T7.1), Crosspoint_control (R95.2)
TERM_EN_7: 8x8_Crosspoint (R16.1 T8.1), Crosspoint_control (R94.2)

## Assembly variants
Default: not fitted IC13 R131 R132 R133